# Altium schematic sheet PC2_Input.SchDoc
size 199 x 199 mm
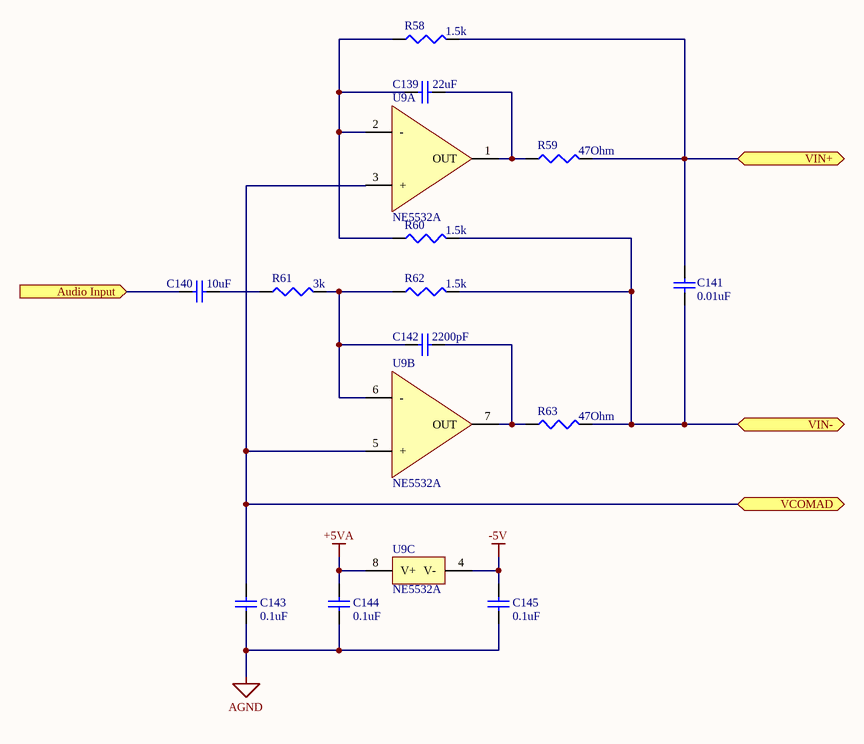
[diagram p0: PC2_Input.SchDoc]

## Parts
C139  22uF  [CAPC1608X08]
C140  10uF  [CAPC1608X08]
C141  value 0.01uF  [CAPC1608X08]  (hidden comment: Cap Semi)
C142  value 2200pF  [CAPC1608X08]  (hidden comment: Cap Semi)
C143  0.1uF  [CAPC1608X08]
C144  0.1uF  [CAPC1608X08]
C145  0.1uF  [CAPC1608X08]
R58  value 1.5k  [RESC1608X05]  (hidden comment: Res3)
R59  value 47Ohm  [RESC1608X05]  (hidden comment: Res3)
R60  value 1.5k  [RESC1608X05]  (hidden comment: Res3)
R61  value 3k  [RESC1608X05]  (hidden comment: Res3)
R62  value 1.5k  [RESC1608X05]  (hidden comment: Res3)
R63  value 47Ohm  [RESC1608X05]  (hidden comment: Res3)
U9  NE5532A  [D8-M]  (parts A,B,C of 3)

## Ports
Audio Input (in), VCOMAD, VIN+, VIN-

## Nets
+5VA: C144.1 U9.8(V+)
-5V: C145.1 U9.4(V-)
AGND: C143.2 C144.2 C145.2
Audio Input: C140.2 ; port Audio Input
VCOMAD: C143.1 U9.3(+) U9.5(+) ; port VCOMAD
VIN+: C141.1 R58.2 R59.2 ; port VIN+
VIN-: C141.2 R60.2 R62.2 R63.2 ; port VIN-
NetC139_1: C139.1 R59.1 U9.1(OUT)
NetC139_2: C139.2 R58.1 R60.1 U9.2(-)
NetC140_1: C140.1 R61.1
NetC142_1: C142.1 R63.1 U9.7(OUT)
NetC142_2: C142.2 R61.2 R62.1 U9.6(-)

## Library data of the parts
C139 = Cap Semi: Capacitor (Semiconductor SIM Model); Fabricant: MURATA; Fournisseur: Farnell; RefFabricant: GRM188R60J226MEA0D; RefFournisseur: 2666490; Value: 22uF; Case: 0603 [1608 Metric]; DataSheet: http://www.farnell.com/datasheets/1955681.pdf
C140 = Cap Semi: Capacitor (Semiconductor SIM Model); Fabricant: MURATA; Fournisseur: Farnell; RefFabricant: GRM188R60J106ME47J; RefFournisseur: 2611921; Value: 10uF; Case: 0603 [1608 Metric]; DataSheet: http://www.farnell.com/datasheets/2079165.pdf
C141 = Cap Semi: Capacitor (Semiconductor SIM Model); Fabricant: MURATA; Fournisseur: Farnell; RefFabricant: GRM188F51E104ZA01D; RefFournisseur: 1828902; Case: 0603 [1608 Metric]; DataSheet: http://www.farnell.com/datasheets/2048672.pdf
C142 = Cap Semi: Capacitor (Semiconductor SIM Model); Fabricant: MURATA; Fournisseur: Farnell; RefFabricant: GRT188R71H222KE01D; RefFournisseur: 2672172; Case: 0603 [1608 Metric]; DataSheet: http://www.farnell.com/datasheets/2165971.pdf
C143-C145 = Cap Semi: Capacitor (Semiconductor SIM Model); Fabricant: MURATA; Fournisseur: Farnell; RefFabricant: GRM188F51E104ZA01D; RefFournisseur: 2821272; Value: 0.1uF; Case: 0603 [1608 Metric]; DataSheet: http://www.farnell.com/datasheets/2048672.pdf
R58 R60 R62 = Res3: Resistor; Fabricant: TE CONNECTIVITY; Fournisseur: Farnell; RefFabricant: RN73C1J1K5BTDF; RefFournisseur: 2613050; Case: 0603 [1608 Metric]; DataSheet: http://www.farnell.com/datasheets/2170353.pdf
R59 R63 = Res3: Resistor; Fabricant: TE CONNECTIVITY; Fournisseur: Farnell; RefFabricant: CPF-A-0603B47RE1; RefFournisseur: 2483931; Case: 0603 [1608 Metric]; DataSheet: http://www.farnell.com/datasheets/1935020.pdf
R61 = Res3: Resistor; Fabricant: TE CONNECTIVITY; Fournisseur: Farnell; RefFabricant: CPF0603B3K0E1; RefFournisseur: 2331191; Case: 0603 [1608 Metric]; DataSheet: http://www.farnell.com/datasheets/2043336.pdf
U9 = NE5532A: Amplificateur Opérationnel; Fabricant: TEXAS INSTRUMENTS; RefFabricant: NE5532AD; Fournisseur: Farnell; RefFournisseur: 1103060; DataSheet: http://www.ti.com/lit/ds/symlink/ne5532a.pdf